# EAGLE design benjolin_1.0 (EAGLE 9.5.1)
Benjolin, layout by forestcaver, 2019. cc-by-nc-sa 4.0 2019 (Permission kindly given by Rob Hordijk for this to be shared and to be used strictly for non-commercial purposes).

## Sheet 1 of 2
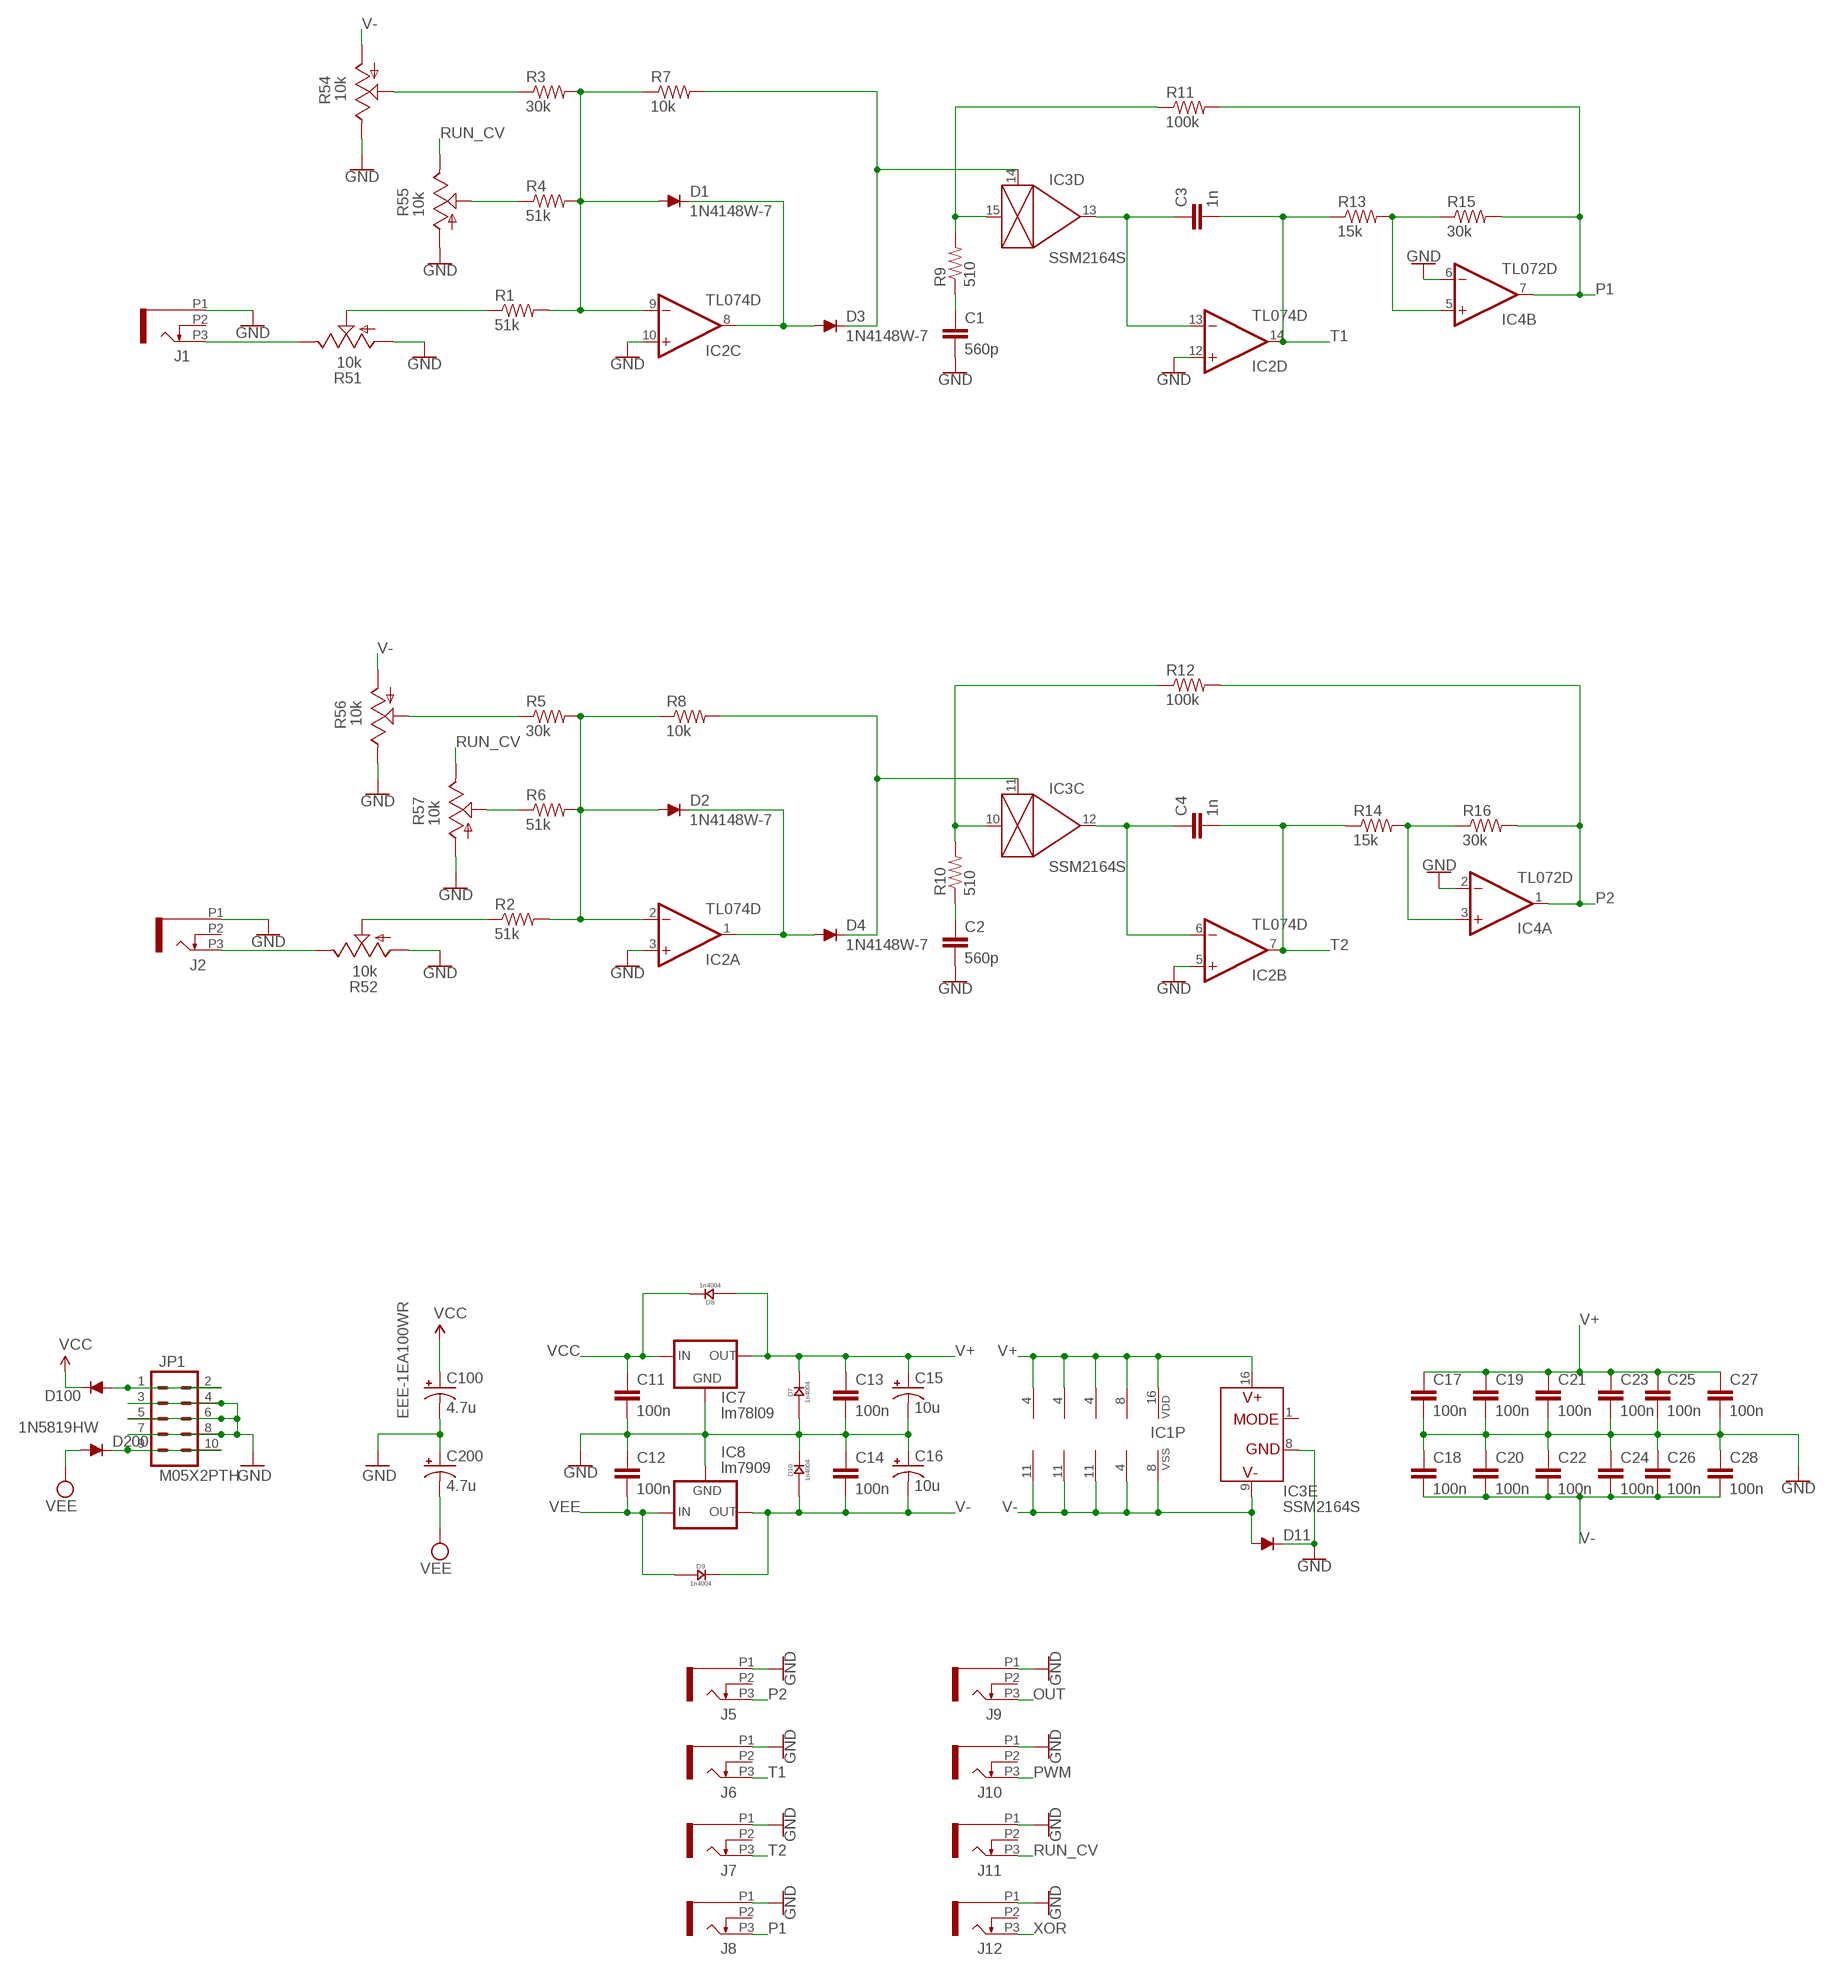
[diagram p0: schematic, sheet 1, part 1 of 2]
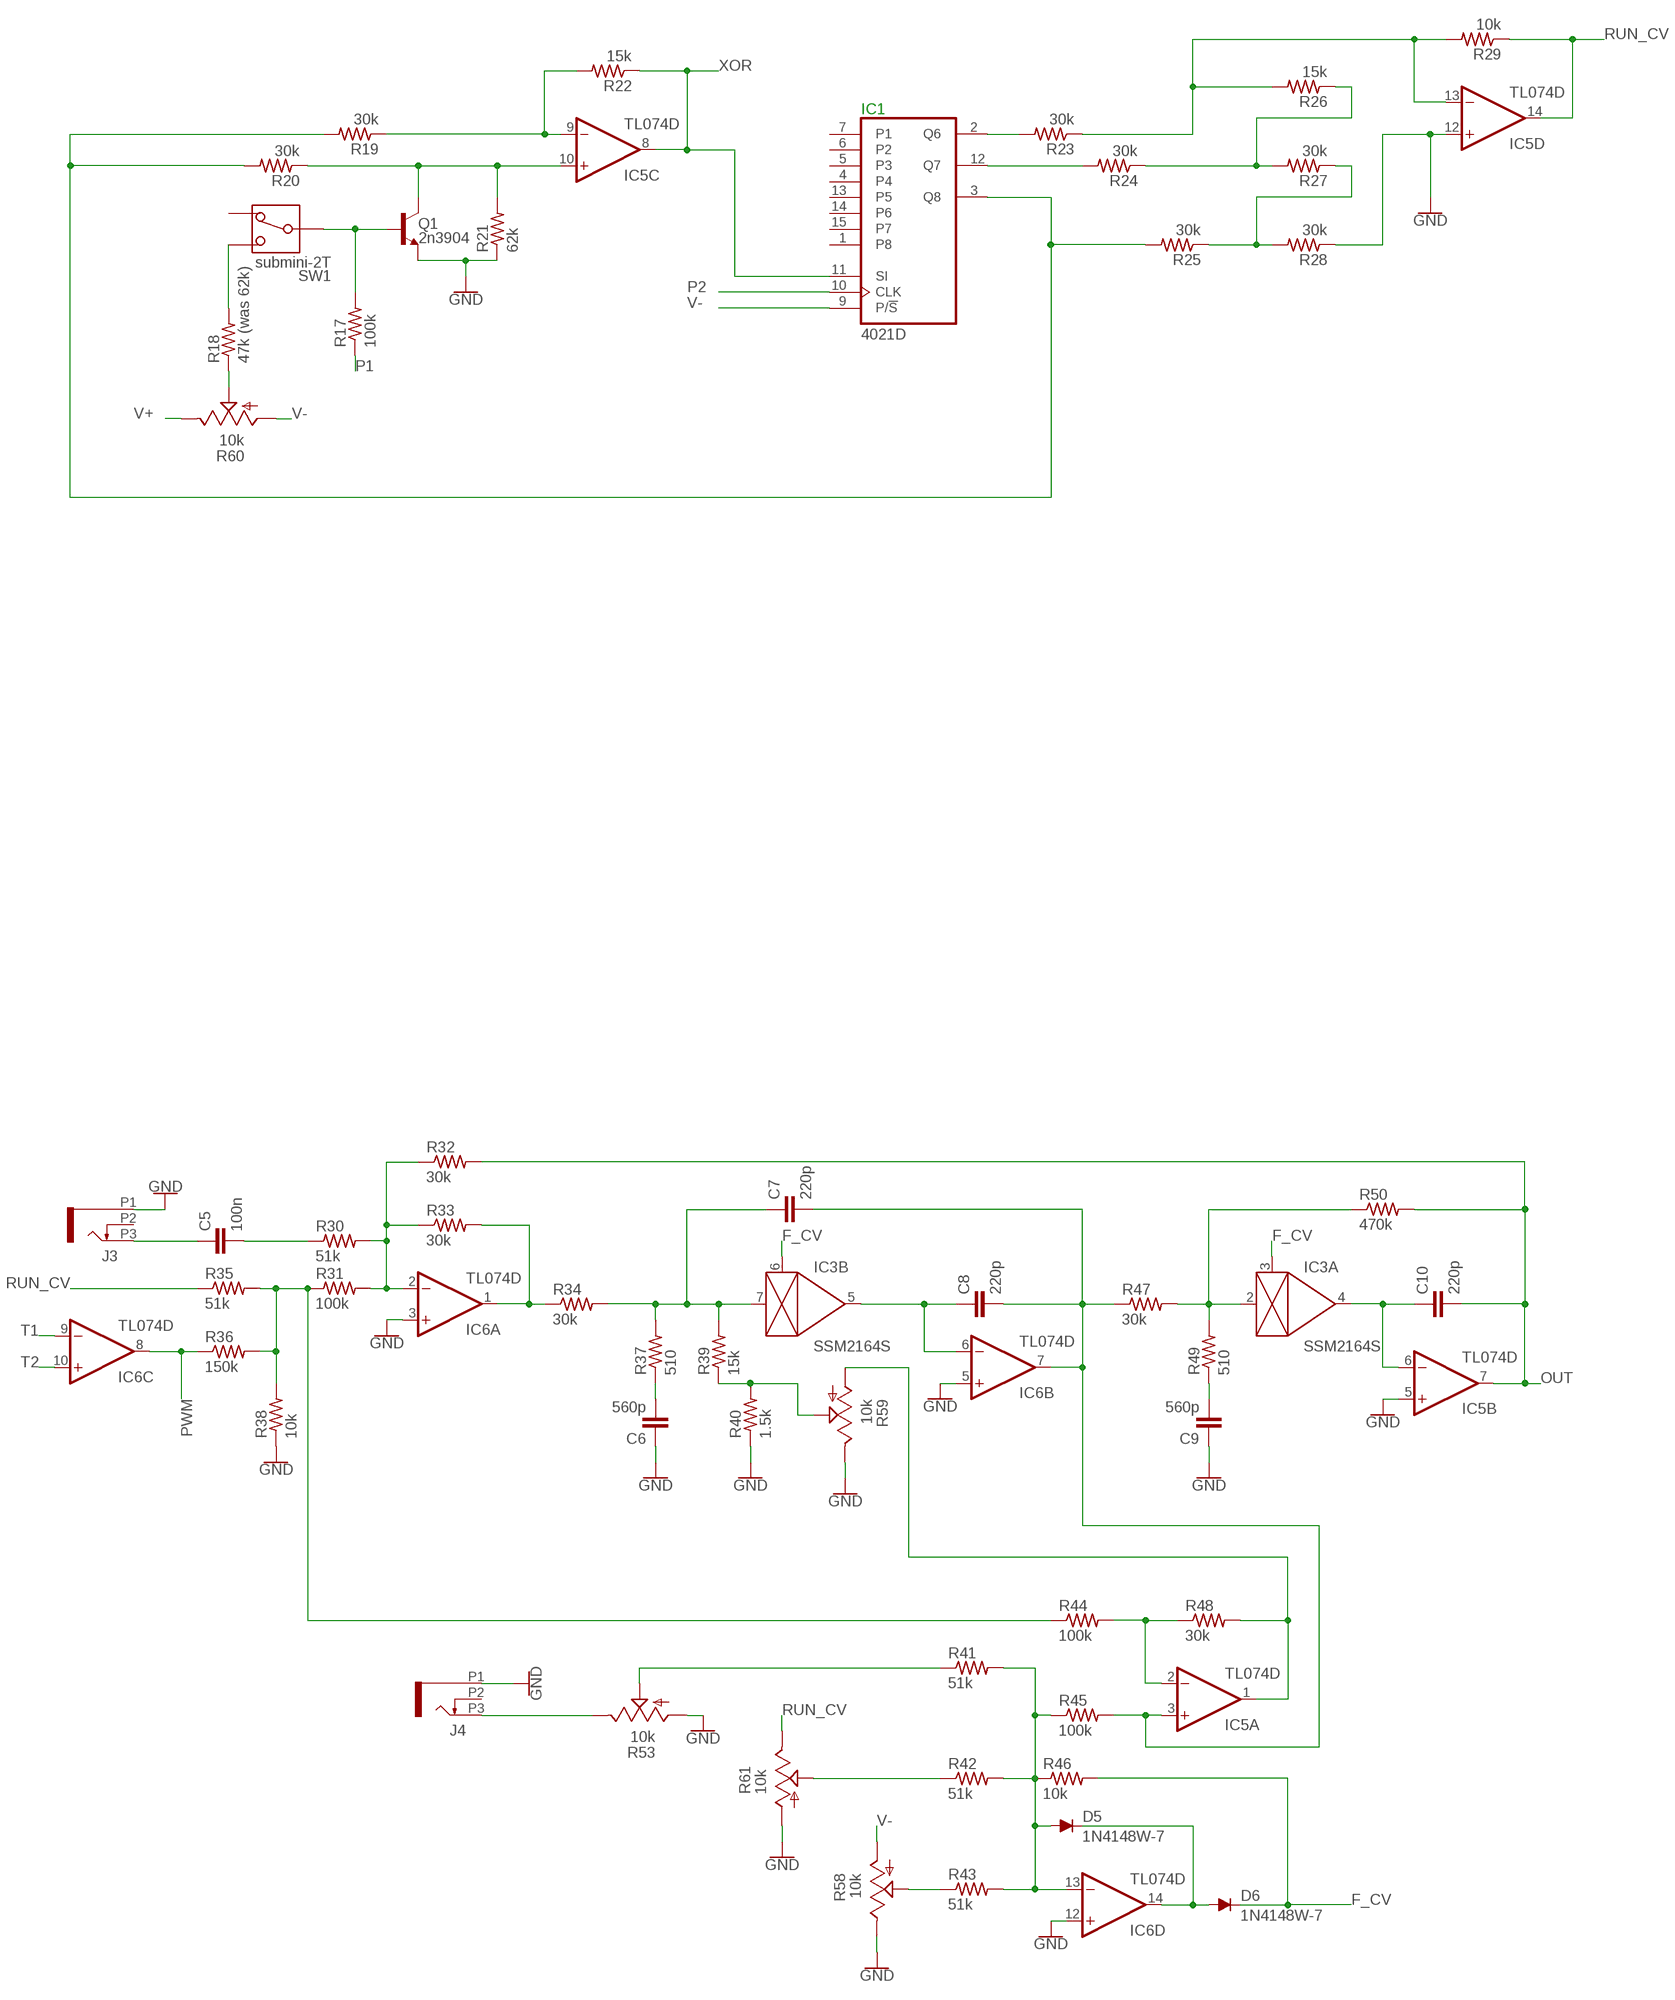
[diagram p1: schematic, sheet 1, part 2 of 2]

### Parts
C1  560p  C-EUC0603  [C0603]
C2  560p  C-EUC0603  [C0603]
C3  1n  C-EUC0603  [C0603]
C4  1n  C-EUC0603  [C0603]
C5  100n  C-EUC0603  [C0603]
C6  560p  C-EUC0603  [C0603]
C7  220p  C-EUC0603  [C0603]
C8  220p  C-EUC0603  [C0603]
C9  560p  C-EUC0603  [C0603]
C10  220p  C-EUC0603  [C0603]
C11  100n  C-EUC0603  [C0603]
C12  100n  C-EUC0603  [C0603]
C13  100n  C-EUC0603  [C0603]
C14  100n  C-EUC0603  [C0603]
C15  10u  CPOL-USA  [PANASONIC_A]
C16  10u  CPOL-USA  [PANASONIC_A]
C17  100n  C-EUC0603  [C0603]
C18  100n  C-EUC0603  [C0603]
C19  100n  C-EUC0603  [C0603]
C20  100n  C-EUC0603  [C0603]
C21  100n  C-EUC0603  [C0603]
C22  100n  C-EUC0603  [C0603]
C23  100n  C-EUC0603  [C0603]
C24  100n  C-EUC0603  [C0603]
C25  100n  C-EUC0603  [C0603]
C26  100n  C-EUC0603  [C0603]
C27  100n  C-EUC0603  [C0603]
C28  100n  C-EUC0603  [C0603]
C100  4.7u  CPOL-USA  [PANASONIC_A]
C200  4.7u  CPOL-USA  [PANASONIC_A]
D1  1N4148W-7  [SOD123]
D2  1N4148W-7  [SOD123]
D3  1N4148W-7  [SOD123]
D4  1N4148W-7  [SOD123]
D5  1N4148W-7  [SOD123]
D6  1N4148W-7  [SOD123]
D7  1n4004  D-SMA  [DO-214AC]
D8  1n4004  D-SMA  [DO-214AC]
D9  1n4004  D-SMA  [DO-214AC]
D10  1n4004  D-SMA  [DO-214AC]
D11  1N5819HW  DIODE-SOD123  [SOD123]
D100  1N5819HW  DIODE-SOD123  [SOD123]
D200  1N5819HW  DIODE-SOD123  [SOD123]
IC1  4021D  [SO16]
IC2  TL074D  [SO14]
IC3  SSM2164S  [SOIC16N]
IC4  TL072D  [SO08]
IC5  TL074D  [SO14]
IC6  TL074D  [SO14]
IC7  lm78l09  78LXX  [78LXX]
IC8  lm7909  79LXX  [79LXX]
J1  PJ301_THONKICONN6  [WQP_PJ_301M6]
J2  PJ301_THONKICONN6  [WQP_PJ_301M6]
J3  PJ301_THONKICONN6  [WQP_PJ_301M6]
J4  PJ301_THONKICONN6  [WQP_PJ_301M6]
J5  PJ301_THONKICONN6  [WQP_PJ_301M6]
J6  PJ301_THONKICONN6  [WQP_PJ_301M6]
J7  PJ301_THONKICONN6  [WQP_PJ_301M6]
J8  PJ301_THONKICONN6  [WQP_PJ_301M6]
J9  PJ301_THONKICONN6  [WQP_PJ_301M6]
J10  PJ301_THONKICONN6  [WQP_PJ_301M6]
J11  PJ301_THONKICONN6  [WQP_PJ_301M6]
J12  PJ301_THONKICONN6  [WQP_PJ_301M6]
JP1  M05X2PTH  [AVR_ICSP]
Q1  2n3904  TRANS_NPN-MMBT2222AL  [SOT23-3]
R1  51k  R-US_R0603  [R0603]
R2  51k  R-US_R0603  [R0603]
R3  30k  R-US_R0603  [R0603]
R4  51k  R-US_R0603  [R0603]
R5  30k  R-US_R0603  [R0603]
R6  51k  R-US_R0603  [R0603]
R7  10k  R-US_R0603  [R0603]
R8  10k  R-US_R0603  [R0603]
R9  510  R-US_R0603  [R0603]
R10  510  R-US_R0603  [R0603]
R11  100k  R-US_R0603  [R0603]
R12  100k  R-US_R0603  [R0603]
R13  15k  R-US_R0603  [R0603]
R14  15k  R-US_R0603  [R0603]
R15  30k  R-US_R0603  [R0603]
R16  30k  R-US_R0603  [R0603]
R17  100k  R-US_R0603  [R0603]
R18  47k (was 62k)  R-US_R0603  [R0603]
R19  30k  R-US_R0603  [R0603]
R20  30k  R-US_R0603  [R0603]
R21  62k  R-US_R0603  [R0603]
R22  15k  R-US_R0603  [R0603]
R23  30k  R-US_R0603  [R0603]
R24  30k  R-US_R0603  [R0603]
R25  30k  R-US_R0603  [R0603]
R26  15k  R-US_R0603  [R0603]
R27  30k  R-US_R0603  [R0603]
R28  30k  R-US_R0603  [R0603]
R29  10k  R-US_R0603  [R0603]
R30  51k  R-US_R0603  [R0603]
R31  100k  R-US_R0603  [R0603]
R32  30k  R-US_R0603  [R0603]
R33  30k  R-US_R0603  [R0603]
R34  30k  R-US_R0603  [R0603]
R35  51k  R-US_R0603  [R0603]
R36  150k  R-US_R0603  [R0603]
R37  510  R-US_R0603  [R0603]
R38  10k  R-US_R0603  [R0603]
R39  15k  R-US_R0603  [R0603]
R40  1.5k  R-US_R0603  [R0603]
R41  51k  R-US_R0603  [R0603]
R42  51k  R-US_R0603  [R0603]
R43  51k  R-US_R0603  [R0603]
R44  100k  R-US_R0603  [R0603]
R45  100k  R-US_R0603  [R0603]
R46  10k  R-US_R0603  [R0603]
R47  30k  R-US_R0603  [R0603]
R48  30k  R-US_R0603  [R0603]
R49  510  R-US_R0603  [R0603]
R50  470k  R-US_R0603  [R0603]
R51  10k  POT_USVERTICAL_NARROW  [ALPS_POT_NARROW]
R52  10k  POT_USVERTICAL_NARROW  [ALPS_POT_NARROW]
R53  10k  POT_USVERTICAL_NARROW  [ALPS_POT_NARROW]
R54  10k  POT_USVERTICAL_PS  [ALPS_POT_VERTICAL_PS]
R55  10k  POT_USVERTICAL_PS  [ALPS_POT_VERTICAL_PS]
R56  10k  POT_USVERTICAL_PS  [ALPS_POT_VERTICAL_PS]
R57  10k  POT_USVERTICAL_PS  [ALPS_POT_VERTICAL_PS]
R58  10k  POT_USVERTICAL_PS  [ALPS_POT_VERTICAL_PS]
R59  10k  POT_USVERTICAL_PS  [ALPS_POT_VERTICAL_PS]
R60  10k  POT_USVERTICAL_PS  [ALPS_POT_VERTICAL_PS]
R61  10k  POT_USVERTICAL_PS  [ALPS_POT_VERTICAL_PS]
SW1  submini-2T  SPDTT  [SPDT-SUB]

### Nets
F_CV: D6.C IC3.3(A:CTRL) IC3.6(B:CTRL) R46.2
GND: C1.2 C2.2 C6.1 C9.1 C11.2 C12.1 C13.2 C14.1 C15.- C16.+ C17.2 C18.1 C19.2 C20.1 C21.2 C22.1 C23.2 C24.1 C25.2 C26.1 C27.2 C28.1 C100.- C200.+ D7.1(+) D10.2(-) D11.C IC2.3(A:+IN) IC2.5(B:+IN) IC2.10(C:+IN) IC2.12(D:+IN) IC3.8(E:GND) IC4.2(A:-IN) IC4.6(B:-IN) IC5.5(B:+IN) IC5.12(D:+IN) IC6.3(A:+IN) IC6.5(B:+IN) IC6.12(D:+IN) IC7.GND IC8.GND J1.P1 J2.P1 J3.P1 J4.P1 J5.P1 J6.P1 J7.P1 J8.P1 J9.P1 J10.P1 J11.P1 J12.P1 JP1.3 JP1.4 JP1.5 JP1.6 JP1.7 JP1.8 Q1.2(E) R21.1 R28.1 R38.1 R40.1 R51.P$3(A) R52.P$3(A) R53.P$3(A) R54.P$1(E) R55.P$3(A) R56.P$1(E) R57.P$3(A) R58.P$1(E) R59.P$1(E) R61.P$3(A)
N$1: J1.P3 R51.P$1(E)
N$2: J2.P3 R52.P$1(E)
N$3: R1.1 R51.P$2(S)
N$4: R2.1 R52.P$2(S)
N$5: D1.A IC2.9(C:-IN) R1.2 R3.2 R4.2 R7.1
N$6: D100.A JP1.1 JP1.2
N$7: D2.A IC2.2(A:-IN) R2.2 R5.2 R6.2 R8.1
N$8: R6.1 R57.P$2(S)
N$9: R5.1 R56.P$2(S)
N$10: R3.1 R54.P$2(S)
N$11: R4.1 R55.P$2(S)
N$12: D1.C D3.A IC2.8(C:OUT)
N$13: D4.C IC3.11(C:CTRL) R8.2
N$14: D2.C D4.A IC2.1(A:OUT)
N$15: D3.C IC3.14(D:CTRL) R7.2
N$16: R43.1 R58.P$2(S)
N$18: C2.1 R10.1
N$19: IC3.10(C:IN) R10.2 R12.1
N$20: D200.C JP1.9 JP1.10
N$21: IC3.15(D:IN) R9.2 R11.1
N$22: C1.1 R9.1
N$23: C4.1 IC2.6(B:-IN) IC3.12(C:OUT)
N$24: C3.1 IC2.13(D:-IN) IC3.13(D:OUT)
N$25: IC4.3(A:+IN) R14.2 R16.1
N$26: IC4.5(B:+IN) R13.2 R15.1
N$27: R18.2 SW1.P$1
N$28: R18.1 R60.P$2(S)
N$29: Q1.1(B) R17.2 SW1.P$2
N$30: IC5.10(C:+IN) Q1.3(C) R20.1 R21.2
N$31: IC5.9(C:-IN) R19.1 R22.2
N$32: IC1.2(Q6) R23.2
N$33: IC1.12(Q7) R24.2
N$34: IC1.3(Q8) R19.2 R20.2 R25.2
N$35: R24.1 R26.1 R27.2
N$36: R25.1 R27.1 R28.2
N$37: IC5.13(D:-IN) R23.1 R26.2 R29.2
N$38: R31.1 R35.2 R36.2 R38.2 R44.1
N$39: C5.1 J3.P3
N$40: C5.2 R30.1
N$41: IC6.2(A:-IN) R30.2 R31.2 R32.1 R33.1
N$42: IC6.1(A:OUT) R33.2 R34.1
N$43: IC5.2(A:-IN) R44.2 R48.1
N$44: R39.1 R40.2 R59.P$2(S)
N$45: C6.2 R37.1
N$46: C7.1 IC3.7(B:IN) R34.2 R37.2 R39.2
N$47: C8.1 IC3.5(B:OUT) IC6.6(B:-IN)
N$48: C7.2 C8.2 IC5.3(A:+IN) IC6.7(B:OUT) R45.2 R47.1
N$49: D5.A IC6.13(D:-IN) R41.2 R42.2 R43.2 R45.1 R46.1
N$50: C9.2 R49.1
N$51: IC3.2(A:IN) R47.2 R49.2 R50.1
N$52: C10.1 IC3.4(A:OUT) IC5.6(B:-IN)
N$53: IC5.1(A:OUT) R48.2 R59.P$3(A)
N$54: D5.C D6.A IC6.14(D:OUT)
N$56: R42.1 R61.P$2(S)
N$57: J4.P3 R53.P$1(E)
N$58: R41.1 R53.P$2(S)
OUT: C10.2 IC5.7(B:OUT) J9.P3 R32.2 R50.2
P1: IC4.7(B:OUT) J8.P3 R11.2 R15.2 R17.1
P2: IC1.10(CLK) IC4.1(A:OUT) J5.P3 R12.2 R16.2
PWM: IC6.8(C:OUT) J10.P3 R36.1
RUN_CV: IC5.14(D:OUT) J11.P3 R29.1 R35.1 R55.P$1(E) R57.P$1(E) R61.P$1(E)
T1: C3.2 IC2.14(D:OUT) IC6.9(C:-IN) J6.P3 R13.1
T2: C4.2 IC2.7(B:OUT) IC6.10(C:+IN) J7.P3 R14.1
V+: C13.1 C15.+ C17.1 C19.1 C21.1 C23.1 C25.1 C27.1 D7.2(-) D8.1(+) IC1.16(VDD) IC2.4(P:V+) IC3.16(E:V+) IC4.8(P:V+) IC5.4(P:V+) IC6.4(P:V+) IC7.OUT R60.P$1(E)
V-: C14.2 C16.- C18.2 C20.2 C22.2 C24.2 C26.2 C28.2 D9.2(-) D10.1(+) D11.A IC1.8(VSS) IC1.9(P/!S) IC2.11(P:V-) IC3.9(E:V-) IC4.4(P:V-) IC5.11(P:V-) IC6.11(P:V-) IC8.OUT R54.P$3(A) R56.P$3(A) R58.P$3(A) R60.P$3(A)
VCC: C11.1 C100.+ D8.2(-) D100.C IC7.IN
VEE: C12.2 C200.- D9.1(+) D200.A IC8.IN
XOR: IC1.11(SI) IC5.8(C:OUT) J12.P3 R22.1
Unconnected: IC1.1(P8) IC1.4 IC1.5(P3) IC1.6(P2) IC1.7(P1) IC1.13(P5) IC1.14(P6) IC1.15(P7) IC3.1(E:MODE) J1.P2 J2.P2 J3.P2 J4.P2 J5.P2 J6.P2 J7.P2 J8.P2 J9.P2 J10.P2 J11.P2 J12.P2 SW1.P$3

### Notes on the sheet
- EEE-1EA100WR

## Sheet 2 of 2

## Library data of the parts
C1-C14 C17-C28 = resistor:C-EU: CAPACITOR, European symbol
C15 C16 C100 C200 = rcl:CPOL-US: POLARIZED CAPACITOR, American symbol
D1-D6 = diode:1N4148: DIODE high speed (Philips)
D7-D10 = OPL:D*: DIODE
D11 D100 D200 = diode:DIODE-: DIODE
IC1 = 40xx:4021: 8-bit static SHIFT REGISTER
IC2 IC5 IC6 = linear:TL074: OP AMP
IC3 = ssm2164:SSM2164
IC4 = linear:TL072: OP AMP
IC7 = v-reg:78LXX: VOLTAGE REGULATOR
IC8 = v-reg:79LXX: VOLTAGE REGULATOR
J1-J12 = og-pj301:PJ301_THONKICONN
JP1 = og-header:M05X2: Header 5x2 Standard 10-pin dual row 0.1" header. Commonly used with AVR-ISP. Use with Spark Fun Electronics SKU: PRT-00778
Q1 = SparkFun-DiscreteSemi:TRANS_NPN: NPN transistor Current controlled devices typically used to amplify current or used as a switch. BC547 - COM-08928 <http://www.sparkfun.com/products/8928> (TO-92 45V 100mA) (1.Collector 2.Base 3.Emitter) 2N3904 - COM-00521 <http://www.sparkfun.com/products/521> (TO-92 40V 200mA) (1.Emitter 2.Base 3.Collector) P2N2222A - COM-12852 <http://www.sparkfun.com/products/12852> (TO-92 40V 600mA) (1.Collector 2.Base 3.Emitter); PROD_ID: TRANS-08049; VALUE: 600mA/40V
R1-R50 = resistor:R-US_: RESISTOR, American symbol
R51-R61 = og-pots:POT_US
SW1 = malekko main:SPDT: SPDT Switch

## Net classes
1 power: width 0.178 mm, drill 0.305 mm, clearance 0.178 mm to class 0, clearance 0.178 mm

## Board
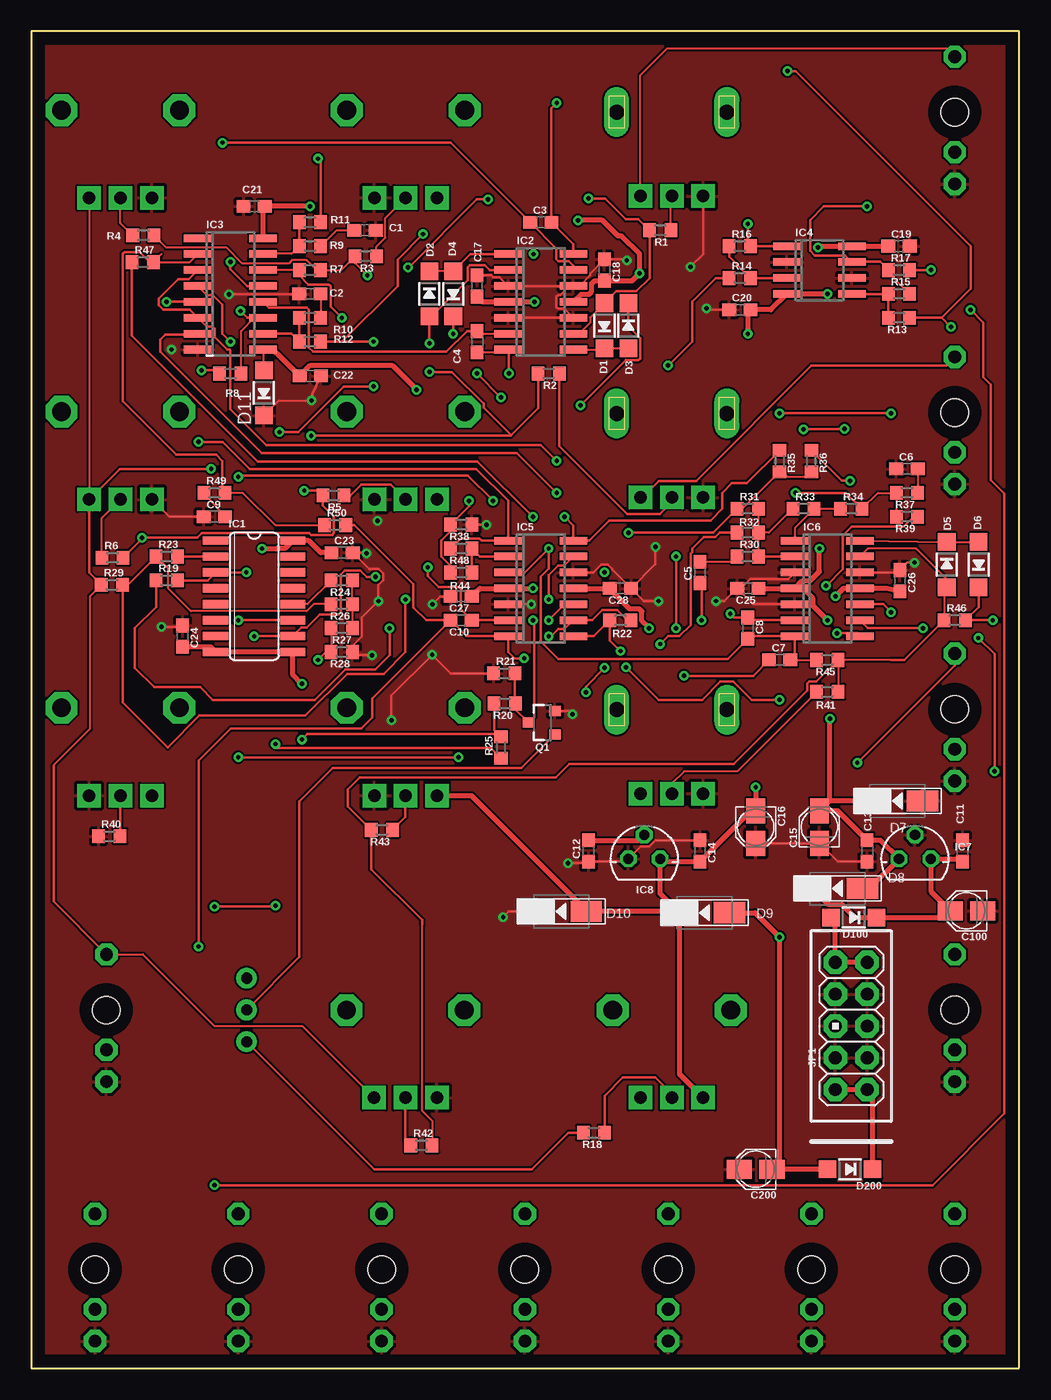
[diagram p2: board, top side]
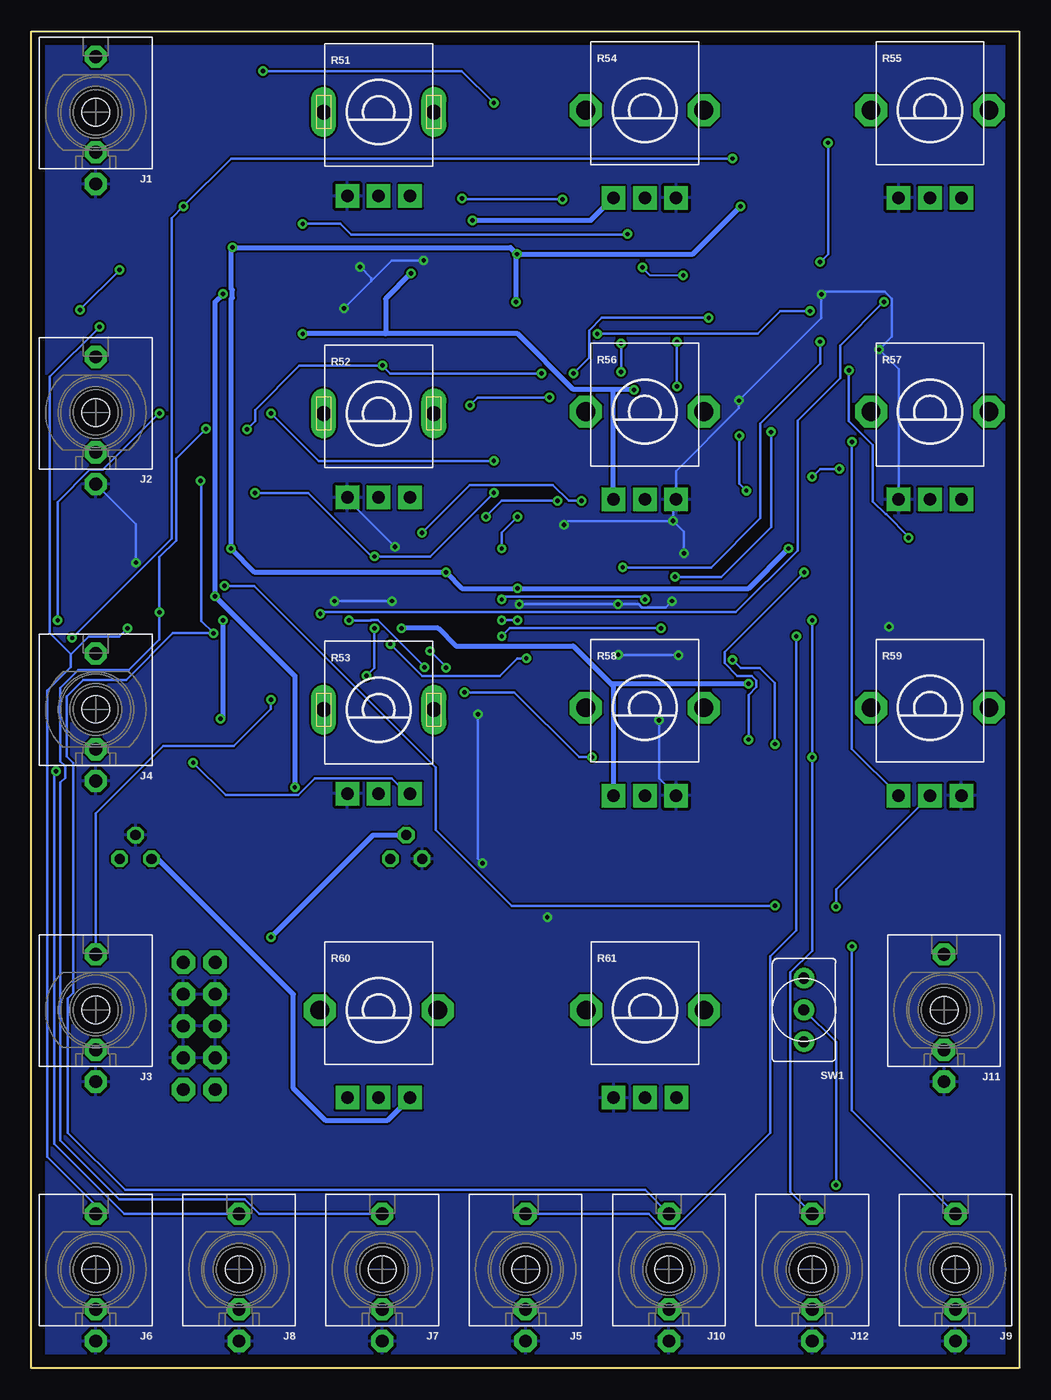
[diagram p3: board, bottom side, seen from below]

Size 78.8 x 106.68 mm. Coordinates in mm from the lower left corner, seen from the top.
Outline: 0,80 0,0
Outline: 0,0 78.8,0 78.8,106.68 0,106.68 0,0
Copper layers (1*16): Top 0.035mm / dielectric 1.5mm / Bottom 0.035mm
Design rules "default": minimum track width 6mil, minimum drill 0.35mm, track to track 6mil, track to pad 6mil, pad to pad 6mil, via to via 6mil, smd to smd 6mil, copper to edge 40mil, drill to drill 6mil, minimum pad ring 10mil, minimum via ring 8mil, stop-mask expansion 4mil, vias tented up to drill 0mil, thermal gap 10mil

### Footprints (pad centres in the part's own frame; a part is rotated, then mirrored left to right if it is on the bottom)
C0603 = smd 1.1 x 1: 1 -0.85,0; 2 0.85,0
PANASONIC_A = smd 2 x 1.5: + 1.3,0; - -1.3,0
SOD123 = smd 1.4 x 1.4: A 1.805,0; C -1.805,0
DO-214AC = smd 2.5 x 1.7: 1 -2,0; 2 2,0
SO16 = smd 0.66 x 2.032: 1 -4.445,-3.073; 2 -3.175,-3.073; 3 -1.905,-3.073; 4 -0.635,-3.073; 5 0.635,-3.073; 6 1.905,-3.073; 7 3.175,-3.073; 8 4.445,-3.073; 9 4.445,3.073; 10 3.175,3.073; 11 1.905,3.073; 12 0.635,3.073; 13 -0.635,3.073; 14 -1.905,3.073; 15 -3.175,3.073; 16 -4.445,3.073
SO14 = smd 0.6 x 2.2: 1 -3.81,-2.6; 2 -2.54,-2.6; 3 -1.27,-2.6; 4 0,-2.6; 5 1.27,-2.6; 6 2.54,-2.6; 7 3.81,-2.6; 8 3.81,2.6; 9 2.54,2.6; 10 1.27,2.6; 11 0,2.6; 12 -1.27,2.6; 13 -2.54,2.6; 14 -3.81,2.6
SOIC16N = smd 0.6 x 2.2: 1 -4.445,-2.6; 2 -3.175,-2.6; 3 -1.905,-2.6; 4 -0.635,-2.6; 5 0.635,-2.6; 6 1.905,-2.6; 7 3.175,-2.6; 8 4.445,-2.6; 9 4.445,2.6; 10 3.175,2.6; 11 1.905,2.6; 12 0.635,2.6; 13 -0.635,2.6; 14 -1.905,2.6; 15 -3.175,2.6; 16 -4.445,2.6
SO08 = smd 0.6 x 2.2: 1 -1.905,-2.6; 2 -0.635,-2.6; 3 0.635,-2.6; 4 1.905,-2.6; 5 1.905,2.6; 6 0.635,2.6; 7 -0.635,2.6; 8 -1.905,2.6
78LXX = drill 0.813 octagon: GND 0,1.905; IN 1.27,0; OUT -1.27,0
79LXX = drill 0.813 octagon: GND -1.27,0; IN 0,1.905; OUT 1.27,0
WQP_PJ_301M6 = drill 1.016 pad 1.778 octagon: P1 0,-5.715; P2 0,-3.175; P3 0,4.445 | hole 2.2: 0,0
AVR_ICSP = drill 1.016 pad 1.88 octagon: 1 -1.27,5.08; 2 1.27,5.08; 3 -1.27,2.54; 4 1.27,2.54; 5 -1.27,0; 6 1.27,0; 7 -1.27,-2.54; 8 1.27,-2.54; 9 -1.27,-5.08; 10 1.27,-5.08
SOT23-3 = smd 0.8 x 0.9: 1 -0.95,-1; 2 0.95,-1; 3 0,1.1
R0603 = smd 1 x 1.1: 1 -0.85,0; 2 0.85,0
ALPS_POT_NARROW = drill 1 pad 1.88 square: P$1 -2.5,6.7; P$2 0,6.7; P$3 2.5,6.7 | drill 1.2 pad 2 long: P$4 -4.4,0; P$5 4.4,0
ALPS_POT_VERTICAL_PS = drill 1 pad 1.88 square: P$1 -2.5,7; P$2 0,7; P$3 2.5,7 | drill 1.5 pad 2.54 octagon: P$4 -4.7,0; P$5 4.7,0
SPDT-SUB = drill 0.889 pad 1.651: P$1 0,2.54; P$2 0,0; P$3 0,-2.54

### Placement (x,y rotation side)
C1  26.62,90.81 0 top
C2  22.23,85.72 180 top
C3  40.64,91.44 0 top
C4  35.56,81.92 270 top
C5  53.34,63.5 90 top
C6  69.85,71.75 0 top
C7  59.69,56.52 0 top
C8  57.15,59.05 270 top
C9  14.61,67.94 0 top
C10  34.29,59.69 180 top
C11  74.3,41.27 90 top
C12  44.45,41.27 90 top
C13  66.67,41.27 270 top
C14  53.34,41.27 270 top
C15  62.87,43.18 90 top
C16  57.78,43.18 270 top
C17  35.56,86.36 90 top
C18  45.72,87.63 270 top
C19  69.22,89.53 0 top
C20  56.52,84.45 0 top
C21  17.78,92.71 180 top
C22  22.25,79.17 180 top
C23  24.79,65.07 0 top
C24  12.06,58.42 270 top
C25  57.15,62.23 180 top
C26  69.29,62.84 270 top
C27  34.29,61.59 180 top
C28  46.99,62.23 180 top
C100  74.6,36.5 180 top
C200  57.78,15.88 180 top
D1  45.72,83.19 90 top
D2  31.75,85.72 270 top
D3  47.62,83.19 270 top
D4  33.66,85.72 90 top
D5  73.03,64.14 270 top
D6  75.56,64.14 90 top
D7  69.09,45.26 180 top
D8  64.31,38.28 180 top
D9  53.7,36.35 180 top
D10  42.27,36.45 180 top
D11  18.54,77.83 90 top
D100  65.61,35.97 180 top
D200  65.31,15.88 180 top
IC1  17.78,61.59 270 top
IC2  40.64,85.09 270 top
IC3  15.88,85.72 270 top
IC4  62.87,87.63 270 top
IC5  40.64,62.23 270 top
IC6  63.5,62.23 270 top
IC7  70.48,40.64 0 top
IC8  48.9,40.64 0 top
J1  73.66,100.21 0 bottom
J2  73.66,76.26 0 bottom
J3  73.66,28.58 0 bottom
J4  73.66,52.58 0 bottom
J5  39.37,7.87 0 bottom
J6  73.66,7.87 0 bottom
J7  50.8,7.87 0 bottom
J8  62.23,7.87 0 bottom
J9  5.08,7.87 0 bottom
J10  27.94,7.87 0 bottom
J11  5.99,28.57 0 bottom
J12  16.51,7.87 0 bottom
JP1  65.41,27.3 0 top
Q1  40.77,51.51 90 top
R1  50.16,90.81 180 top
R2  41.27,79.38 180 top
R3  26.67,88.72 180 top
R4  8.94,90.4 0 top
R5  24.1,69.65 180 top
R6  6.48,64.67 0 top
R7  22.23,87.63 180 top
R8  15.88,79.38 0 top
R9  22.23,89.53 180 top
R10  22.23,83.82 180 top
R11  22.23,91.44 0 top
R12  22.23,81.92 0 top
R13  69.22,83.82 180 top
R14  56.52,87 0 top
R15  69.22,85.72 0 top
R16  56.52,89.53 0 top
R17  69.22,87.63 0 top
R18  44.88,18.8 180 top
R19  10.79,62.87 0 top
R20  37.77,53.04 180 top
R21  37.72,55.45 0 top
R22  46.99,59.69 0 top
R23  10.79,64.77 0 top
R24  24.77,62.87 180 top
R25  37.47,49.53 90 top
R26  24.77,60.96 180 top
R27  24.77,59.05 0 top
R28  24.77,57.15 180 top
R29  6.43,62.51 0 top
R30  57.15,64.77 0 top
R31  57.15,68.58 0 top
R32  57.15,66.67 180 top
R33  61.59,68.58 0 top
R34  65.41,68.58 0 top
R35  59.69,72.39 270 top
R36  62.23,72.39 270 top
R37  69.85,69.85 180 top
R38  34.29,67.31 180 top
R39  69.85,67.94 180 top
R40  6.22,42.44 0 top
R41  63.5,53.98 0 top
R42  31.11,17.78 0 top
R43  27.97,42.95 180 top
R44  34.29,63.5 0 top
R45  63.5,56.52 180 top
R46  73.66,59.69 0 top
R47  8.89,88.27 0 top
R48  34.29,65.41 180 top
R49  14.61,69.85 0 top
R50  24.23,67.28 0 top
R51  51.09,100.24 180 bottom
R52  51.09,76.18 180 bottom
R53  51.09,52.55 180 bottom
R54  29.86,100.39 180 bottom
R55  7.11,100.39 180 bottom
R56  29.86,76.33 180 bottom
R57  7.11,76.33 180 bottom
R58  29.86,52.7 180 bottom
R59  7.11,52.7 180 bottom
R60  51.09,28.57 180 bottom
R61  29.84,28.57 180 bottom
SW1  17.17,28.59 180 bottom

### Tracks (layer width: path | path; a pad name or v marks a point on that pad's centre or on a via)
F_CV  (via drill 0.35)
  Top 0.203: IC3.3 12.56,86.91 11.72,86.91 10.16,85.35 10.16,84.83 10.53,84.46 12.64,84.46 IC3.6 13.99,83.1 14.48,83.1 14.63,82.95 14.63,82.27 15.61,81.28 15.81,81.28 15.88,81.22 15.88,76.53 18.75,73.66 40.64,73.66 v41.91,72.39 | v59.69,76.2 v68.58,76.2 | v76.69,59.69 R46.2 75.56,60.74 D6.C
  Bottom 0.203: v41.91,72.39 55.88,72.39 v59.69,76.2 | v68.58,76.2 73.09,71.69 74.13,71.69 76.69,69.13 v76.69,59.69
GND  (via drill 0.35)
  Top 0.152: D11.C 19.74,77.22 v22.35,77.22
  Top 0.203: C17.2 36.7,87.21 36.84,87.08 37.32,87.08 IC2.3 42.93,86.36 | IC2.5 IC2.10 42.52,84.54 42.03,84.54 41.89,84.69 41.89,85.5 42.03,85.64 42.21,85.64 42.93,86.36 | C25.2 56.59,62.23 57.34,62.98 60.38,62.98 IC6.3 | C25.2 57.57,60.96 IC6.5 | C14.1 49.77,42.12 49.27,41.63 48.62,41.63 IC8.GND 47.41,40.42 C12.1 44.34,40.31 v42.82,40.31 | C16.+ C15.- 64.32,40.42 C13.2 | 42.93,86.36 IC2.12 43.73,86.36 44.59,87.22 44.59,87.35 C18.1 47.41,88.48 v47.5,88.39 | v53.85,84.58 53.98,84.45 C20.1 | R51.P$3 53.59,88.9 v52.58,87.88 | C2.2 15.72,85.72 v15.77,85.67 | v11.18,81.28 | IC5.12 44.83,63.5 45.46,64.13 45.98,64.13 46.35,63.76 46.35,63.72 C28.1 | C28.1 49.78,64.17 v49.78,65.53 | C28.1 48.86,61.21 v50.04,61.21 | v54.61,61.21 55.28,61.21 C25.2 | IC5.5 v39.88,60.96 | v32,60.96 32.64,61.59 C27.2 | R21.1 33.45,55.45 v31.98,56.92 28.73,53.67 v28.73,51.71 | v27.18,56.9 25.87,56.9 R28.1 25.61,57.65 26.37,58.4 26.37,59.9 v27.69,61.21 27.69,62.48 28.09,62.88 28.09,63.41 27.72,63.78 26.94,63.78 C23.2 26.7,65.08 v26.74,65.04 | R38.1 36.27,67.31 v36.3,67.28 | IC6.12 69.1,63.5 C26.1 69.89,64.29 v70.46,64.29 | C22.1 22.41,77.72 v22.35,77.22 | C9.1 11,67.94 R57.P$3 | C24.1 11.95,59.16 v10.39,59.16 | D10.2 38.1,36.45 v37.64,35.99 | Q1.2 42.89,52.46 v43.18,52.17
  Bottom 0.203: v47.5,88.39 50.04,88.39 51.69,86.74 | 51.69,86.74 v53.85,84.58 | v52.58,87.88 51.69,87 51.69,86.74 | v49.78,65.53 53.59,69.34 R52.P$3 | v50.04,61.21 v54.61,61.21 | v39.88,60.96 v32,60.96 30.36,60.96 30.11,60.71 28.19,60.71 v27.69,61.21 | v27.18,56.9 31.95,56.9 v31.98,56.92 | v28.73,51.71 28.73,47.06 R58.P$1 | v27.61,67.61 27.61,69.09 R56.P$1 27.36,71.59 22.35,76.61 v22.35,77.22 15.77,83.8 v15.77,85.67 15.54,85.9 10.71,85.9 10.16,85.35 10.16,82.3 v11.18,81.28 9.61,79.72 R57.P$3 | v70.46,64.29 70.46,67.34 J2.P1 | v26.74,65.04 26.74,66.74 v27.61,67.61 | v27.61,67.61 35.97,67.61 v36.3,67.28 | v43.18,52.17 43.18,40.66 v42.82,40.31
  pour Top: -9.91,104.14 -4.57,104.14 4.83,113.54 76.45,113.54 85.6,104.39 90.68,99.31 90.68,8.38 90.68,-0.51 77.47,-13.72 2.29,-13.72 1.78,-13.21 -10.41,-1.02 -10.41,-0.25 -10.41,103.63
  pour Bottom: -19.05,98.81 1.78,119.63 8.13,119.63 76.71,119.63 81.28,115.06 99.31,97.03 99.31,94.49 100.08,93.73 100.08,1.02 89.15,-9.91 85.6,-9.91 84.58,-10.92 2.79,-10.92 0.51,-10.92 -13.21,2.79 -19.05,8.64
N$1
  Top 0.152: R51.P$1 48.59,103.19 50.7,105.29 73.03,105.29 J1.P3
N$2
  Top 0.203: R52.P$1 48.73,69.48 50.05,70.8 53.02,70.8 62.23,80.01 72.96,80.01 J2.P3
N$3
  Top 0.152: R1.1 51.02,93.46 R51.P$2
N$4
  Top 0.203: R52.P$2 51.09,69.11 50.14,68.16 47.55,68.16 42.12,73.58 R2.1
N$5  (via drill 0.35)
  Top 0.152: D1.A 44.57,83.84 44.57,83.42 43.69,82.55 IC2.9 | R4.2 10.76,89.43 15.57,89.43 16.84,88.16 20.53,88.16 20.78,88.41 21.97,88.41 22.75,87.63 R7.1 24.73,87.63 R3.2 25.82,88.17 v26.8,87.2
  Top 0.203: 23.5,87.63 R7.1 22.78,87.63 | v44.45,93.34 45.77,93.34 47.42,91.69 48.43,91.69 R1.2 49.31,87 48.26,85.94 46.67,85.94 D1.A | v36.42,93.27 35.53,93.27 30.1,87.83 v30.05,87.83
  Bottom 0.152: v30.05,87.83 29.41,87.2 v26.8,87.2
  Bottom 0.203: v36.42,93.27 44.37,93.27 v44.45,93.34
N$6
  Top 0.406: JP1.2 JP1.1 64.14,35.63 D100.A
N$7  (via drill 0.35)
  Top 0.203: R8.1 14.77,79.63 v13.59,79.63 | R2.2 40.42,76.62 38.27,74.46 | IC2.2 36.55,87.63 36.16,88.01 34.95,88.01 34.81,87.86 34.81,86.83 31.9,83.92 D2.A v31.75,81.79 | 38.27,74.46 38.23,74.42 22.35,74.42 v22.33,74.4 | v21.77,70.03 22.87,70.03 R5.2 23.25,68.82 24.14,67.94 24.14,66.63 23.99,66.48 22.33,66.48 22.19,66.62 13.59,66.62 13.23,66.27 v8.81,66.27 8.81,66.16 R6.2 | 38.27,74.46 36.09,76.64 36.09,76.96 33.55,79.5 v31.75,79.5
  Bottom 0.203: v13.59,79.63 13.59,75.57 11.69,73.67 11.69,69.17 10.66,68.14 10.61,68.14 8.81,66.34 v8.81,66.27 | v31.75,81.79 v31.75,79.5 | v22.33,74.4 22.33,70.59 v21.77,70.03
N$8
  Top 0.152: R6.1 5.63,67.85 R57.P$2
N$9
  Top 0.203: R5.1 25.44,69.65 26.32,70.53 28.67,70.53 R56.P$2
N$10
  Top 0.152: R3.1 27.52,89.48 28.25,90.21 28.25,91.77 R54.P$2
N$11
  Top 0.152: R4.1 7.11,91.38 R55.P$2
N$12
  Top 0.152: IC2.8 45.62,81.28 D1.C D3.A
N$13  (via drill 0.35)
  Top 0.152: R8.2 16.73,82.77 17.78,83.82 IC3.11
  Top 0.203: v33.66,82.55 D4.C | v16.69,84.35 17.22,83.82 IC3.11
  Bottom 0.203: v33.66,82.55 20.85,82.55 19.05,84.35 v16.69,84.35
N$14
  Top 0.152: D4.A D2.C
  Top 0.203: D4.A 35.02,88.9 IC2.1
N$15  (via drill 0.35)
  Top 0.152: R7.2 IC3.14
  Top 0.203: v43.81,76.83 47.41,80.43 48.43,80.43 48.58,80.58 48.58,82.19 47.62,83.14 D3.C | v37.47,77.47 v35.56,79.38 | R7.2 21.38,87.21 22.11,86.48 23.73,86.48 23.88,86.33 23.88,84.71 v24.77,83.82
  Bottom 0.203: v43.81,76.83 43.18,77.47 v37.47,77.47 | v35.56,79.38 34.29,80.65 34.29,82.81 33.28,83.82 v24.77,83.82
N$16
  Top 0.203: R43.1 29.83,43.97 29.83,45.67 R58.P$2
N$18
  Top 0.152: C2.1 R10.1
N$19
  Top 0.203: IC3.10 20.74,82.55 R12.1 R10.2
N$20
  Top 0.406: JP1.9 JP1.10 67.11,21.79 D200.C
N$21
  Top 0.152: IC3.15 18.45,88.93 20.77,88.93 R9.2
  Top 0.203: R11.1 R9.2
N$22
  Top 0.152: R9.1 24.34,90.81 C1.1
N$23
  Top 0.152: C4.1 35.77,82.55 IC2.6
  Top 0.203: C4.1 34.76,82.77 33.11,81.11 22.47,81.11 22.13,81.45 22.13,84.47 21.98,84.62 18.94,84.62 IC3.12
N$24  (via drill 0.35)
  Top 0.203: v15.24,97.79 33.44,97.79 C3.1 41.89,89.34 41.89,88.5 42.03,88.35 42.88,88.35 43.24,87.99 IC2.13 | v15.88,88.27 15.88,87.69 17.2,86.36 IC3.13
  Bottom 0.203: v15.24,97.79 15.24,88.9 v15.88,88.27
N$25
  Top 0.203: IC4.3 R14.2 55.66,88.69 R16.1
N$26
  Top 0.203: IC4.5 R15.1 R13.2
N$27
  Top 0.203: SW1.P$1 27.34,15.88 39.9,15.88 42.82,18.8 R18.2
N$28
  Top 0.203: R60.P$2 51.09,21.88 49.77,23.2 47.19,23.2 45.73,21.74 R18.1
N$29  (via drill 0.35)
  Top 0.203: R17.2 v71.75,87.63 | v74.93,84.45 75.95,83.44 75.95,79.07 76.52,78.49 76.52,70.88 77.61,69.79 77.61,20.32 71.89,14.61 v14.61,14.61 | 41.47,50.56 Q1.1 39.09,47.88 24.05,47.88 21.39,45.21 21.39,32.81 SW1.P$2 17.88,28.59
  Bottom 0.203: v71.75,87.63 v74.93,84.45 | SW1.P$2 14.61,26.02 v14.61,14.61
N$30  (via drill 0.35)
  Top 0.203: 43.24,60.9 IC5.10 42.55,60.96 v41.27,59.69 | v40.01,59.69 40.12,59.57 40.12,51.97 Q1.3 38.62,52.56 R20.1 38.57,53.09 R21.2
  Bottom 0.203: v40.01,59.69 v41.27,59.69
N$31  (via drill 0.35)
  Top 0.203: R19.1 9.95,60.74 8.26,59.05 8.26,55.88 9.79,54.35 13.46,54.35 14.47,53.34 22.62,53.34 25.05,55.77 27.42,55.77 28.57,56.92 v28.57,59.05 | v41.27,58.42 41.48,58.42 42.03,58.97 42.52,58.97 IC5.9 44.73,59.69 45.53,60.49 46.74,60.49 47.55,59.69 R22.2 47.84,60.03
  Bottom 0.203: v28.57,59.05 40.64,59.05 v41.27,58.42
N$32
  Top 0.203: R23.2 IC1.2
N$33
  Top 0.152: R24.2 22.01,60.96 IC1.12
N$34  (via drill 0.35)
  Top 0.203: R25.2 37.38,50.46 37.25,50.6 | v21.59,50.16 22.02,50.6 37.25,50.6 | R19.2 14.07,62.87 IC1.3 v17.14,63.5 | R20.2 36.92,50.92 37.25,50.6
  Bottom 0.203: v21.59,50.16 21.59,53.72 20.96,54.35 20.96,54.87 21.33,55.24 22.48,55.24 23.49,56.25 23.49,57.15 v17.14,63.5
N$35
  Top 0.152: R24.1 R26.1 R27.2
N$36  (via drill 0.35)
  Top 0.152: R27.1 R28.2
  Top 0.203: R25.1 36.65,49.49 19.48,49.49 v19.48,49.81 | v22.86,56.52 23.5,57.15 R28.2
  Bottom 0.203: v19.48,49.81 19.48,54.67 20.69,55.88 22.22,55.88 v22.86,56.52
N$37  (via drill 0.35)
  Top 0.152: R26.2 22.52,60.96 21.96,60.4 12.74,60.4 10.92,62.22 10.92,63.8 R23.1 7.68,62.51 R29.2
  Top 0.203: R29.2 7.28,53.12 10.87,49.53 13.4,52.07 21.85,52.07 25.19,55.41 28.11,55.41 29.84,57.15 v29.84,61.34 | IC5.13 42.52,64.05 42.03,64.05 41.27,63.29 v41.27,61.34
  Bottom 0.203: v41.27,61.34 41.02,61.59 30.1,61.59 v29.84,61.34
N$38  (via drill 0.35)
  Top 0.152: R31.1 56.73,68.58 57.27,69.12 57.27,69.22 57.41,69.36 57.51,69.36 R35.2 59.91,71.54 60.33,71.12 61.81,71.12 R36.2
  Top 0.203: R44.1 33.44,64 32.69,64.75 32.69,66.06 33.44,66.81 R38.2 34.92,68.8 v34.92,69.22 | v47.62,66.67 54.4,66.67 R31.1
  Bottom 0.203: v34.92,69.22 35.94,69.22 37.2,70.48 43.82,70.48 v47.62,66.67
N$39  (via drill 0.35)
  Top 0.203: v47.43,55.95 50.04,53.34 53.51,53.34 54.97,54.8 56.01,54.8 57.47,53.34 v59.69,53.34 | C5.1 53.47,62.52 v53.47,59.67
  Bottom 0.203: v53.47,59.67 51.72,59.67 51.7,59.69 51.17,59.69 v47.43,55.95 | J3.P3 73.66,44.27 68.29,49.64 62.65,49.64 59.69,52.6 v59.69,53.34
N$40
  Top 0.152: C5.2 55.88,64.35 R30.1
N$41
  Top 0.152: R33.1 58.84,66.67 R32.1 | R32.1 R30.2 | R31.2 R32.1
  Top 0.203: IC6.2 R30.2
N$42
  Top 0.152: IC6.1 60.9,67.03 R33.2 R34.1
N$43
  Top 0.203: R44.2 R48.1 35.77,64.77 IC5.2
N$44  (via drill 0.35)
  Top 0.203: v14.61,36.83 19.41,36.83 v19.48,36.91 | v63.4,62.43 64.75,63.77 64.75,66.44 65.44,67.14 69.61,67.14 70.41,67.94 R39.1 | R40.2 7.07,45.66 R59.P$2
  Bottom 0.203: v14.61,36.83 14.61,38.21 R59.P$2 | v19.48,36.91 40.49,36.91 46.53,42.95 46.53,47.95 61,62.43 v63.4,62.43
N$45
  Top 0.152: C6.2 R37.1
N$46  (via drill 0.35)
  Top 0.152: R34.2 67.53,69.85 R37.2 R39.2
  Top 0.203: IC3.7 13.19,82.47 10.67,82.47 10.29,82.08 10.29,81.13 18.39,73.03 38.73,73.03 v41.91,69.85 | v51.44,64.77 v51.44,59.05 | C7.1 57.57,55.24 v52.07,55.24 | v60.96,69.85 64.98,69.85 R34.2
  Bottom 0.203: v41.91,69.85 46.99,64.77 v51.44,64.77 51.62,64.77 56.7,69.85 v60.96,69.85 | v51.44,59.05 51.44,55.88 v52.07,55.24
N$47  (via drill 0.35)
  Top 0.203: IC3.5 v10.79,85.09 | v55.75,60.2 56.05,59.91 C8.1 57.37,59.69 IC6.6
  Bottom 0.203: v55.75,60.2 55.62,60.33 22.6,60.33 17.68,65.24 17.68,75.61 14.28,79.02 14.28,81.61 v10.79,85.09
N$48  (via drill 0.35)
  Top 0.152: IC6.7 60.9,58.27 | C7.2 60.71,56.52 R45.2
  Top 0.203: IC5.3 38.07,63.47 39.34,63.47 v41.27,65.41 | R47.1 8.03,88.25 8.03,82.4 18.06,72.36 35.59,72.36 v40.01,67.94 | 40.62,64.75 v41.27,65.41 | v41.27,65.41 41.27,63.8 40.64,63.16 40.64,58.04 40.62,58.02 42.03,56.6 55.54,56.6 C8.2 57.37,58.42 IC6.7 60.9,56.71 60.71,56.52
  Top 0.406: C7.2 60.69,56.66
  Bottom 0.203: v40.01,67.94 41.27,66.67 v41.27,65.41
N$49
  Top 0.152: IC6.13 66.73,65.41 70.58,65.41 73.03,62.97 D5.A | D5.A 72.81,62.55 R46.1 | D5.A 73.71,61.65 | 68.58,56.52 R45.1 R41.2 | 31.18,35.41 31.18,20.54 31.96,19.75 R42.2
  Top 0.203: R46.1 69.64,56.52 68.58,56.52 | R45.1 62.61,54.78 62.05,54.78 61.9,54.63 61.9,54.06 56.04,48.21 42.9,48.21 41.84,47.15 26.22,47.15 25.25,46.18 25.25,44.82 R43.2 27.11,39.81 31.18,35.75 31.18,35.41
N$50
  Top 0.203: R49.1 C9.2
N$51
  Top 0.152: 10.38,88.9 R47.2 12.64,88.27 IC3.2 | R50.1 19.45,67.28 16.88,69.85 R49.2
  Top 0.203: R47.2 9.45,88.27 8.64,89.07 7.43,89.07 7.29,88.92 7.29,77.17 11.56,72.9 14.73,72.9 15.24,72.39 15.24,70.06 R49.2
N$52  (via drill 0.35)
  Top 0.203: IC5.6 C10.1 34.24,60.59 34.24,62.2 34.09,62.35 32.48,62.35 31.62,63.21 v31.62,63.91 | IC3.4 13.99,85.64 14.48,85.64 15.24,84.88 15.24,82.55 v15.88,81.92
  Bottom 0.203: v31.62,63.91 24.56,63.91 20.65,67.82 20.65,75.39 15.88,80.16 v15.88,81.92
N$53  (via drill 0.35)
  Top 0.203: 33.7,65.66 R48.2 34.24,66.21 35.74,66.21 35.91,66.04 IC5.1 38.04,69.22 35.5,71.75 17.41,71.75 15.25,73.91 v13.34,73.91
  Bottom 0.203: v13.34,73.91 13.34,49.42 R59.P$3
N$54
  Top 0.152: IC6.14 D5.C D6.A
N$56
  Top 0.203: R61.P$2 29.84,18.2 R42.1
N$57  (via drill 0.35)
  Top 0.152: 48.59,45.92 R53.P$1
  Top 0.203: J4.P3 73.66,56.08 v65.89,48.31
  Bottom 0.203: 73.66,56.72 J4.P3 | R53.P$1 48.85,45.85 50.05,47.04 56.2,47.04 57.52,45.72 63.3,45.72 v65.89,48.31
N$58
  Top 0.152: R41.1 56.3,47.62 52.07,47.62 51.09,46.65 R53.P$2
OUT  (via drill 0.35)
  Top 0.203: IC5.7 37.96,58.5 | C10.2 33.67,59.46 | IC5.7 38.04,57.15 38.55,56.64 v39.32,56.64 | v13.34,33.66 13.34,48.48 15.91,51.05 26.3,51.05 27.2,51.94 27.2,53.45 C10.2 | C10.2 34.71,58.42 IC5.7 | v50.16,57.78 50.8,58.42 51.7,58.42 52.59,59.31 52.59,65 52.7,65.12 52.7,65.41 53.62,66.32 54.54,66.32 54.9,66.67 R32.2 | C10.2 31.5,59.69 30.48,60.71 30.48,62.58 25.77,67.28 R50.2 25.08,67
  Bottom 0.203: v13.34,33.66 13.34,20.57 J9.P3 | v50.16,57.78 47.62,55.24 41.43,55.24 40.03,56.64 v39.32,56.64
P1  (via drill 0.35)
  Top 0.203: IC4.7 65.44,88.3 | 65.44,88.3 64.94,88.79 62.49,88.79 62.12,89.16 62.12,91.61 63.22,92.71 v66.67,92.71 | R11.2 23.07,96.31 v22.86,96.52 | 65.44,88.3 67.7,88.3 R17.1 68.36,87.42 R15.2 | v76.83,47.62 76.83,56.97 v75.54,58.27
  Bottom 0.203: v75.54,58.27 67.61,66.19 67.61,91.77 v66.67,92.71 62.87,96.52 v22.86,96.52 | J8.P3 71.4,12.32 76.99,17.91 76.99,47.47 v76.83,47.62
P2  (via drill 0.35)
  Top 0.203: v17.78,58.42 IC1.10 21.54,59.11 21.98,59.11 23.02,60.16 24.52,60.16 24.67,60.3 24.67,63.33 25.01,63.67 26.22,63.67 26.75,63.14 v27.46,63.14 | v57.15,91.31 57.15,89.75 R16.2 IC4.1 | v31.24,90.5 29.21,88.47 29.21,86.36 24.77,81.92 | 24.77,81.92 R12.2 | v27.3,78.33 24.92,78.33 21.29,74.7 v19.79,74.7 | v27.3,81.92 24.77,81.92
  Bottom 0.203: v17.78,58.42 17.78,34.93 19.86,32.84 19.86,18.78 27.47,11.18 28.41,11.18 29.56,12.32 J5.P3 | v57.15,91.31 54.14,91.31 53.27,90.45 31.29,90.45 v31.24,90.5 | v19.79,74.7 19.79,67.11 23.75,63.14 v27.46,63.14 | v27.3,78.33 v27.3,81.92
PWM  (via drill 0.35)
  Top 0.203: R36.1 64.66,70.81 v65.3,70.81 | v64.26,58.65 65.87,58.65 IC6.8
  Bottom 0.203: 27.98,12.32 J10.P3 29.84,14.22 71.32,14.22 75.88,18.78 75.88,29.5 75.44,29.94 75.44,48.28 75.98,48.83 75.98,53.61 74.68,54.91 71.25,54.91 67.51,58.65 v64.26,58.65 65.25,59.64 65.25,70.76 v65.3,70.81
RUN_CV  (via drill 0.35)
  Top 0.152: 4.61,69.98 R57.P$1 R55.P$1 | J11.P3 8.89,33.02 14.61,27.3 21.61,27.3 R61.P$1 | 4.61,63.47 R29.1 4.66,61.59 4.66,51.06 4.68,51.04 | 4.7,51.03 4.68,51.04 | 1.78,48.11 1.78,48.13 4.68,51.04
  Top 0.203: v36.83,69.22 34.81,71.24 16.63,71.24 v16.51,71.12 | v42.55,67.94 43.24,67.25 IC5.14 44.5,66.04 46.1,67.64 54.18,67.64 55.12,68.58 55.12,69.85 55.88,70.61 57.06,70.61 R35.1 | 4.61,63.47 R57.P$1 7.04,71.75 v14.35,71.75 | J11.P3 1.78,37.23 1.78,48.11
  Bottom 0.203: v42.55,67.94 41.27,69.22 v36.83,69.22 | v16.51,71.12 15.88,71.75 v14.35,71.75
T1  (via drill 0.35)
  Top 0.203: v71.12,59.05 66.73,59.05 IC6.9 | 72.61,83.82 74.93,86.14 74.93,89.53 60.96,103.5 v60.33,103.5 | v41.91,100.97 41.49,100.55 C3.2 43.24,89.69 IC2.14 | R13.1 72.61,83.82 | 72.61,83.82 72.62,83.82 v73.36,83.08
  Bottom 0.203: v71.12,59.05 71.78,58.39 74.21,58.39 75.65,56.95 | J6.P3 73.66,13.01 77.52,16.87 77.52,54.09 75.65,55.96 75.65,56.95 | v60.33,103.5 44.45,103.5 v41.91,100.97 | 75.65,56.95 75.65,56.98 77.33,58.65 77.33,79.11 v73.36,83.08
T2  (via drill 0.35)
  Top 0.152: C4.2 37.83,81.06 IC2.7
  Top 0.203: IC6.10 67.94,60.96 v68.58,60.33 | IC2.7 38.1,81.22 v38.1,79.38 | v50.8,80.01 52.7,81.92 52.7,85.09 54.61,87 R14.1 | v64.87,74.95 61.62,74.95 v61.59,74.93
  Bottom 0.203: v38.1,79.38 50.16,79.38 v50.8,80.01 57.41,80.01 60.96,76.46 60.96,75.57 v61.59,74.93 | J7.P3 60.61,12.32 61.76,13.46 71.78,13.46 76.49,18.17 76.49,46.72 76.1,47.11 76.1,48.04 76.49,48.42 76.49,54.27 75.06,55.7 71.04,55.7 68.58,58.16 v68.58,60.33 68.58,64.72 67.26,66.05 67.26,72.56 v64.87,74.95
V+  (via drill 0.35)
  Top 0.406: C19.1 IC4.8 62.87,89.53 v62.75,89.42 | C23.1 23.09,65.08 22.12,66.04 IC1.16 20.27,65.46 19.69,65.46 19.64,65.41 v18.41,65.41 | C25.1 IC6.4 | v63.5,59.69 62.36,60.83 62.36,61.41 61.53,62.23 IC6.4 | IC6.4 61.51,62.84 62.15,62.84 62.87,63.56 v62.87,65.41 | C17.1 35.98,85.09 IC2.4 v40.13,85.09 | IC3.16 18.48,92.56 C21.1 v22.23,92.71 | v40.01,62.23 IC5.4 35.77,62.23 C27.1 | D8.1 66.85,38.28 IC7.OUT 67.73,42.12 C13.1 64.32,44.48 C15.+ 63.65,45.26 | D7.2 63.65,45.26 | 63.65,45.26 63.7,45.32 v63.7,51.82
  Bottom 0.406: v40.07,88.9 40.6,89.42 v62.75,89.42 62.87,89.31 62.87,86.13 62.77,86.03 62.77,85.42 62.87,85.32 v62.87,65.41 60.96,63.5 v45.72,63.5 44.45,62.23 v40.01,62.23 21.59,62.23 v18.41,65.41 | v22.23,92.71 26.04,88.9 v40.07,88.9 | R60.P$1 50.42,19.75 55.31,19.75 57.9,22.34 57.9,29.83 68.71,40.64 IC7.OUT | v40.13,85.09 40.13,88.84 v40.07,88.9 | v63.7,51.82 63.5,52.02 v63.5,59.69
V-  (via drill 0.35)
  Top 0.152: 43.69,85.09 IC2.11 | D11.A 18.54,81.21
  Top 0.203: 18.54,81.21 IC3.9
  Top 0.406: IC8.OUT 50.38,40.42 C14.2 57.4,44.48 C16.- v57.78,46.35 | C26.2 68.23,62.23 IC6.11 64.77,62.23 v64.14,61.59 | v63.5,85.72 IC4.4 58.99,84.45 C20.2 57.15,84.24 v57.15,82.55 | IC2.11 43.85,85.7 44.49,85.7 44.7,85.91 44.7,86.55 44.93,86.78 C18.2 47.92,86.78 v48.51,87.38 48.51,88.9 47.07,90.35 46.8,90.35 45.56,91.59 v43.61,91.59 | 20.95,57.05 IC1.9 | IC1.9 IC1.8 14.29,57.57 C24.2 | v21.59,54.61 20.85,55.35 IC1.9 | IC5.11 C28.2 46.14,62.19 47.73,60.6 48.49,60.6 48.7,60.39 48.7,59.63 v49.28,59.05 | IC3.9 19.26,81.28 19.58,80.96 19.64,80.93 C22.2 22.26,80.03 28.79,80.03 v30.73,78.08 | IC8.OUT 50.16,40.49 | 44.35,36.45 51.59,36.45 D9.2 | 44.35,36.45 D10.1 | D9.2 50.16,37.88 IC8.OUT | D9.2 51.7,23.47 R60.P$3 | R58.P$3 35.1,45.7 44.35,36.45
  Bottom 0.406: v57.78,46.35 57.78,55.24 v64.14,61.59 64.14,85.09 v63.5,85.72 | v49.28,59.05 46.35,59.05 44.93,57.63 35.57,57.63 32.55,54.61 | 50.55,82.55 v57.15,82.55 | 50.55,82.55 40.01,82.55 35.56,78.11 32.41,78.11 32.36,78.06 | v48.51,87.38 50.55,85.34 50.55,82.55 | R56.P$3 32.36,78.06 | R58.P$3 32.36,54.42 32.55,54.61 | v21.59,54.61 32.55,54.61 | v43.61,91.59 34.16,91.59 R54.P$3 | v30.73,78.08 32.34,78.08 32.36,78.06
VCC
  Top 0.406: C11.1 74.08,40.64 IC7.IN 71.75,38.05 C100.+ 72.77,35.97 67.44,35.97 D100.C | 67.72,36.27 D100.C | D8.2 63.57,37.02 64.65,37.02 65.7,35.97 D100.C
VEE  (via drill 0.35)
  Top 0.406: D200.A 59.69,15.88 | 59.69,15.88 C200.- | C12.2 48.48,42.12 IC8.IN | 59.69,15.88 v59.69,34.38 57.73,36.35 D9.1
  Bottom 0.406: v59.69,34.38 51.53,42.55 IC8.IN
XOR  (via drill 0.35)
  Top 0.203: v16.51,59.69 IC1.11 | v44.25,53.92 44.25,54.41 v45.72,55.88 | v34.06,48.77 34.04,48.74 v16.51,48.74 | IC5.8 44.87,58.42 R22.1 46.14,58.08 v46.99,57.23
  Bottom 0.203: v16.51,59.69 v16.51,48.74 16.51,33.31 18.25,31.58 18.25,14.06 J12.P3 | v46.99,57.23 45.72,55.96 v45.72,55.88 | v34.06,48.77 35.1,48.77 40.26,53.92 v44.25,53.92